# Altium schematic sheet BoardB-FPGA3.SchDoc
size A; SheetNumber: 5; SheetTotal: 9
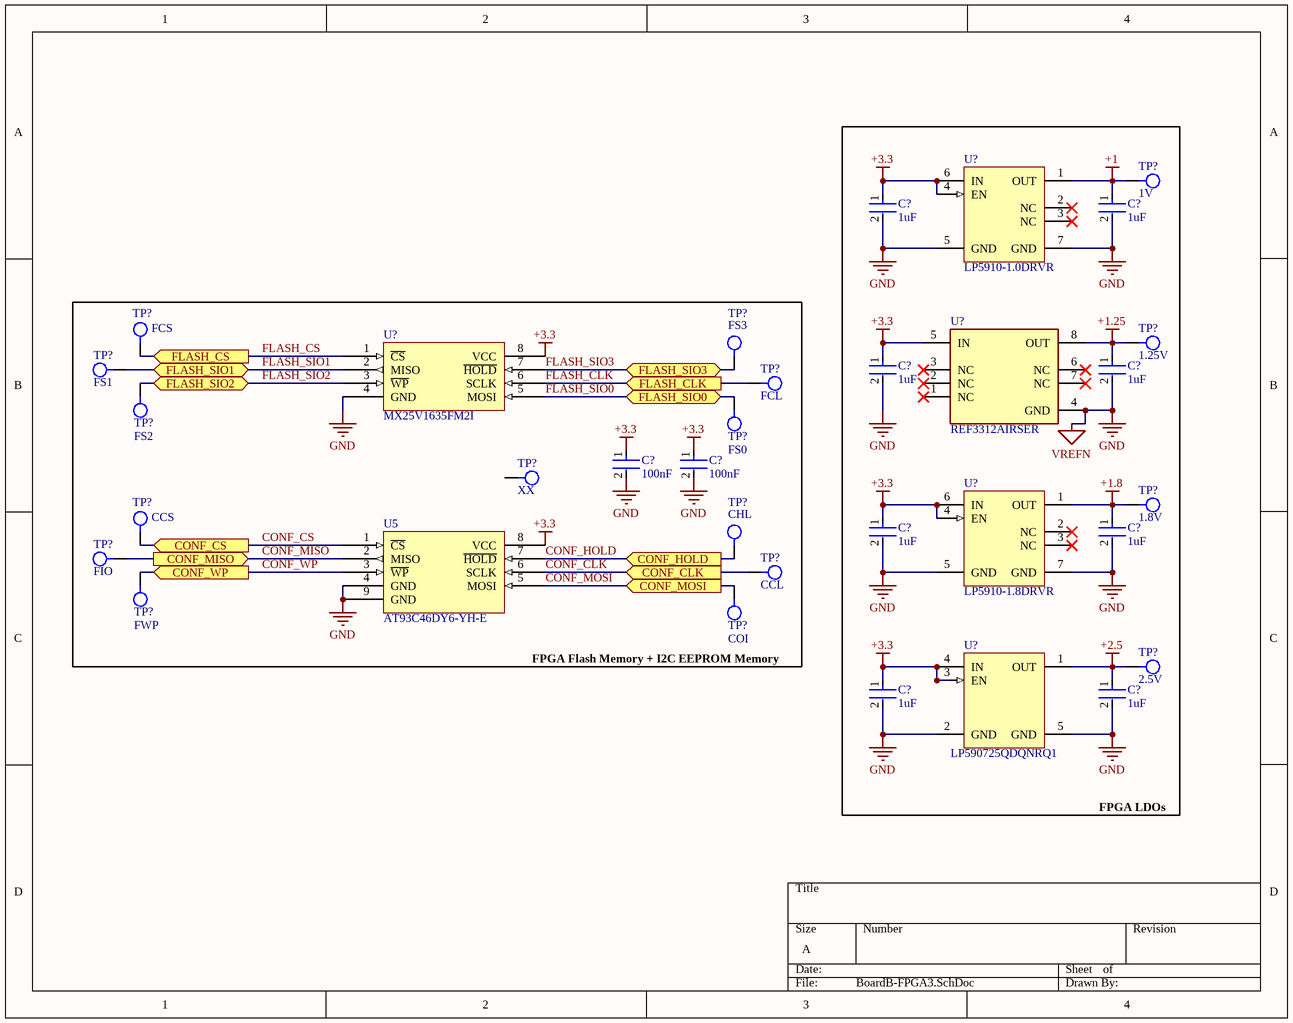
[diagram p0: BoardB-FPGA3.SchDoc]

## Parts
(Parts that share a designator on the sheet are numbered #1, #2 ... from top to bottom, then left to right.)
C?#1  1uF  [FP-C0603C105K3PACTU-MFG]
C?#2  1uF  [FP-C0603C105K3PACTU-MFG]
C?#3  1uF  [FP-C0603C105K3PACTU-MFG]
C?#4  1uF  [FP-C0603C105K3PACTU-MFG]
C?#5  100nF  [FP-C0402-BB-MFG]
C?#6  100nF  [FP-C0402-BB-MFG]
C?#7  1uF  [FP-C0603C105K3PACTU-MFG]
C?#8  1uF  [FP-C0603C105K3PACTU-MFG]
C?#9  1uF  [FP-C0603C105K3PACTU-MFG]
C?#10  1uF  [FP-C0603C105K3PACTU-MFG]
TP?#1  1V
TP?#2  1.25V
TP?#3  FCS
TP?#4  FS1
TP?#5  FS3
TP?#6  FS2
TP?#7  FCL
TP?#8  FS0
TP?#9  XX
TP?#10  1.8V
TP?#11  CCS
TP?#12  FIO
TP?#13  CHL
TP?#14  FWP
TP?#15  CCL
TP?#16  COI
TP?#17  2.5V
U5  AT93C46DY6-YH-E  [AT93C46DY6-YH-E]
U?#1  LP5910-1.0DRVR  [LP5910]
U?#2  REF3312AIRSER  [FP-RSE0008A-MFG]
U?#3  MX25V1635FM2I
U?#4  LP5910-1.8DRVR  [LP5910]
U?#5  LP590725QDQNRQ1  [LP5907]

## Blocks framed on the sheet
FPGA LDOs: C?#1-C?#4 C?#7-C?#10 TP?#1 TP?#2 TP?#10 TP?#17 U?#1 U?#2 U?#4 U?#5
FPGA Flash Memory + I2C EEPROM Memory: C?#5 C?#6 TP?#3-TP?#9 TP?#11-TP?#16 U5 U?#3

## Ports
CONF_CLK (in), CONF_CS (in), CONF_HOLD (in), CONF_MISO (out), CONF_MOSI (in), CONF_WP (in), FLASH_CLK (in), FLASH_CS (in), FLASH_SIO0 (bidir), FLASH_SIO1 (bidir), FLASH_SIO2 (bidir), FLASH_SIO3 (bidir)

## Nets
+1: C?#2.1 TP?#1.1 U?#1.1(OUT)
+1.8: C?#8.1 TP?#10.1 U?#4.1(OUT)
+1.25: C?#4.1 TP?#2.1 U?#2.8(OUT)
+2.5: C?#10.1 TP?#17.1 U?#5.1(OUT)
+3.3: C?#1.1 C?#3.1 C?#5.1 C?#6.1 C?#7.1 C?#9.1 U5.8(VCC) U?#1.4(EN) U?#1.6(IN) U?#2.5(IN) U?#3.8(VCC) U?#4.4(EN) U?#4.6(IN) U?#5.3(EN) U?#5.4(IN)
GND: C?#1.2 C?#2.2 C?#3.2 C?#4.2 C?#5.2 C?#6.2 C?#7.2 C?#8.2 C?#9.2 C?#10.2 U5.4(GND) U5.9(GND) U?#1.5(GND) U?#1.7(GND) U?#2.4(GND) U?#3.4(GND) U?#4.5(GND) U?#4.7(GND) U?#5.2(GND) U?#5.5(GND)  [also labelled VREFN]
CONF_CLK: TP?#15.1 U5.6(SCLK) ; port CONF_CLK
CONF_CS: TP?#11.1 U5.1(~{CS}) ; port CONF_CS
CONF_HOLD: TP?#13.1 U5.7(~{HOLD}) ; port CONF_HOLD
CONF_MISO: TP?#12.1 U5.2(MISO) ; port CONF_MISO
CONF_MOSI: TP?#16.1 U5.5(MOSI) ; port CONF_MOSI
CONF_WP: TP?#14.1 U5.3(~{WP}) ; port CONF_WP
FLASH_CLK: TP?#7.1 U?#3.6(SCLK) ; port FLASH_CLK
FLASH_CS: TP?#3.1 U?#3.1(~{CS}) ; port FLASH_CS
FLASH_SIO0: TP?#8.1 U?#3.5(MOSI) ; port FLASH_SIO0
FLASH_SIO1: TP?#4.1 U?#3.2(MISO) ; port FLASH_SIO1
FLASH_SIO2: TP?#6.1 U?#3.3(~{WP}) ; port FLASH_SIO2
FLASH_SIO3: TP?#5.1 U?#3.7(~{HOLD}) ; port FLASH_SIO3

Not connected (* = marked no-connect by the designer): TP?#9 1; U?#1 2(NC)* 3(NC)*; U?#2 1(NC)* 2(NC)* 3(NC)* 6(NC)* 7(NC)*; U?#4 2(NC)* 3(NC)*

## Library data of the parts
C?#1-C?#4 C?#7-C?#10 = CMP-2006-02216-3: CAP CER 1UF 25V X5R 0603; Dielectric Material: Ceramic; Tolerance: 10%; Contact Plating: Tin; Number of Pins: 2; Lead Free: Lead Free; Depth: 0.8mm; Length: 1.6mm; Mount: Surface Mount; Case Code (Metric): 1608; Max Operating Temperature: 85°C; Voltage: 25V; Voltage Rating (DC): 25V; REACH SVHC: No SVHC; Height: 0.8mm; Series: C0603C; Case/Package: 0603; Case Code (Imperial): 0603; Capacitance: 1uF; RoHS Compliant: Yes; Dielectric: X5R; Packaging: Tape and Reel; Construction: Flat; Thickness: 0.034inch; Voltage Rating: 25V; Radiation Hardening: No; Width: 0.031inch; Min Operating Temperature: -55°C; Termination: SMD/SMT; Package Quantity: 4000
C?#5 C?#6 = CMP-2008-02046-2: CAP CER 0.1UF 10V X5R 0402; Manufacturer: Kemet; Manufacturer Part Number: C0402C104K8PACTU; Material: Ceramic; Capacitance: 0.10 μF; Temperature Coefficient: 15%; Tolerance: 0.1; Value: 0.10 μF; Package: C0402-BB; Temperature: -55°C to +125°C; ComponentLink2Description: Datasheet; Temperature Characteristic: X5R; Device Class L1: Passive Components; Height: 0.55mm; Lead Free: Yes; ComponentLink2URL: https://content.kemet.com/datasheets/KEM_C1002_X7R_SMD.pdf; Device Class L2: Capacitors; Temperature Range Low: -55°C; Temperature Range High: +125°C; RoHS: TRUE; Octopart: https://octopart.com/c0402c104k8pactu-kemet-140039; Automotive: No; Mouser Description: Capacitor 100 nF 10 VDC 0402; Category: Cap; Voltage Rating: 10 V; Digikey Description: CAP CER 0.1UF 10V X5R 0402; Ipc Land Pattern Name: CAPC10050X50; Device Class L3: Ceramic Capacitors
TP?#1-TP?#17 = TestPoint1mm
U5 = AT93C46DY6-YH-E: EEPROM Memory IC 1Kb (128 x 8, 64 x 16) SPI 8-UDFN (2x3); Manufacturer: Microchip; Manufacturer Part Number: AT25040B-MAHL-E; RoHS: Yes; Supplier 1: Digi-Key; Supplier Part Number 1: AT93C46DY6-YH-ECT-ND
U?#1 = LP5910-1.0DRVR: LDO Regulator Pos 1V 0.3A 6-Pin WSON EP T/R; Manufacturer: Texas Instruments; Output Current: 300mA; Number of Regulators: 1; Quiescent Current: 12uA; Dropout Voltage: 120mV; Supplier 1: Mouser; RoHS: Yes; Stock 1: 2189; Pricing 1: 1=0.63000, 10=0.53700, 50=0.53700, 100=0.37200, 1000=0.24400, 10000=0.19500 (USD); Mount: Surface Mount; Min Operating Temperature: -40°C; Max Operating Temperature: 125°C; Packaging: Tape and Reel; Output Voltage: 1V; Lead Free: Lead Free; RoHS Compliant: Yes; ComponentLink1URL: http://www.ti.com/lit/ds/symlink/lp5910.pdf?src-supplier=Digi-Key; ComponentLink1Description: http://www.ti.com/lit/ds/symlink/lp5910.pdf?src-supplier=Digi-Key; ComponentLink2URL: http://www.ti.com/general/docs/suppproductinfo.tsp?distId=10&amp;gotoUrl=http%3A%2F%2Fwww.ti.com%2Flit%2Fgpn%2Flp5910&src-supplier=Digi-Key; ComponentLink2Description: http://www.ti.com/general/docs/suppproductinfo.tsp?distId=10&amp;gotoUrl=http%3A%2F%2Fwww.ti.com%2Flit%2Fgpn%2Flp5910&src-supplier=Digi-Key; Manufacturer Part Number: LP5910-1.0DRVR; Supplier Part Number 1: 595-LP5910-1.0DRVR; Category: Voltage Regulators - Linear
U?#2 = CMP-04916-000026-1: IC VREF SERIES 0.15% 8UQFN; Output Current: 5mA; Operating Supply Current: 8.5uA; Temperature Coefficient: 30ppm/°C; Output Type: Fixed; Min Output Voltage: 1.25V; Tolerance: 0.15%; Min Operating Temperature: -40°C; Max Operating Temperature: 125°C; RoHS Compliant: Yes; Reference Type: Series; Number of Pins: 8; Mount: Surface Mount; Packaging: Tape and Reel
U?#3 = MX25V1635FM2I: IC FLASH 16M SPI 80MHZ 8SOP; Manufacturer: Macronix; Memory Type: FLASH,NOR; Interface: SPI,Serial; Supplier 1: Digi-Key; Manufacturer Part Number: MX25V1635FM2I; RoHS: Yes; Category: Memory; Stock 1: 14366; Pricing 1: 1=0.71000, 10=0.64700, 25=0.63880, 50=0.63480, 100=0.56770, 250=0.56288, 500=0.55456, 1000=0.53472, 5000=0.48704 (USD); Case/Package: SOIC; Min Operating Temperature: -40°C; Max Operating Temperature: 85°C; Packaging: Rail/Tube; Frequency: 80MHz; Lead Free: Lead Free; RoHS Compliant: Yes; ComponentLink1URL: http://ckassoc.com/oldsite/pdf/Macronix_Product_Line_Card_July_2017_General%20_070617.pdf?src-supplier=Digi-Key; ComponentLink1Description: http://ckassoc.com/oldsite/pdf/Macronix_Product_Line_Card_July_2017_General%20_070617.pdf?src-supplier=Digi-Key; Supplier Part Number 1: 1092-1189-ND
U?#4 = LP5910-1.8DRVR: IC REG LINEAR 1.8V 300MA 6SON; Manufacturer: Texas Instruments; Dropout Voltage: 145mV; Number of Regulators: 1; Quiescent Current: 12uA; Supplier 1: Digi-Key; RoHS: Yes; Stock 1: 556; Pricing 1: 1=0.63000, 10=0.53700, 25=0.50080, 100=0.40070, 250=0.37208, 500=0.31482, 1000=0.24327 (USD); Mount: Surface Mount; Min Operating Temperature: -40°C; Max Operating Temperature: 125°C; Packaging: Tape and Reel; Output Voltage: 1.8V; Output Current: 300mA; Lead Free: Lead Free; RoHS Compliant: Yes; ComponentLink1URL: http://www.ti.com/general/docs/suppproductinfo.tsp?distId=10&amp;gotoUrl=http%3A%2F%2Fwww.ti.com%2Flit%2Fgpn%2Flp5910&src-supplier=Digi-Key; ComponentLink1Description: http://www.ti.com/general/docs/suppproductinfo.tsp?distId=10&amp;gotoUrl=http%3A%2F%2Fwww.ti.com%2Flit%2Fgpn%2Flp5910&src-supplier=Digi-Key; ComponentLink2URL: http://www.ti.com/lit/ds/symlink/lp5910.pdf?src-supplier=Digi-Key; ComponentLink2Description: http://www.ti.com/lit/ds/symlink/lp5910.pdf?src-supplier=Digi-Key; Manufacturer Part Number: LP5910-1.8DRVR; Supplier Part Number 1: 296-47212-1-ND; Category: Voltage Regulators - Linear
U?#5 = LP590725QDQNRQ1: LDO Regulator Pos 1.2V to 4.5V 0.25A 4-Pin X2SON EP T/R; Manufacturer: Texas Instruments; Supplier 1: Digi-Key; RoHS: Yes; Stock 1: 2810; Pricing 1: 1=0.64000, 10=0.56000, 25=0.52560, 100=0.42910, 250=0.39856, 500=0.33920, 1000=0.28000 (USD); Manufacturer Part Number: LP590725QDQNRQ1; Supplier Part Number 1: 296-LP590725QDQNRQ1CT-ND; Category: Integrated Circuits (ICs)